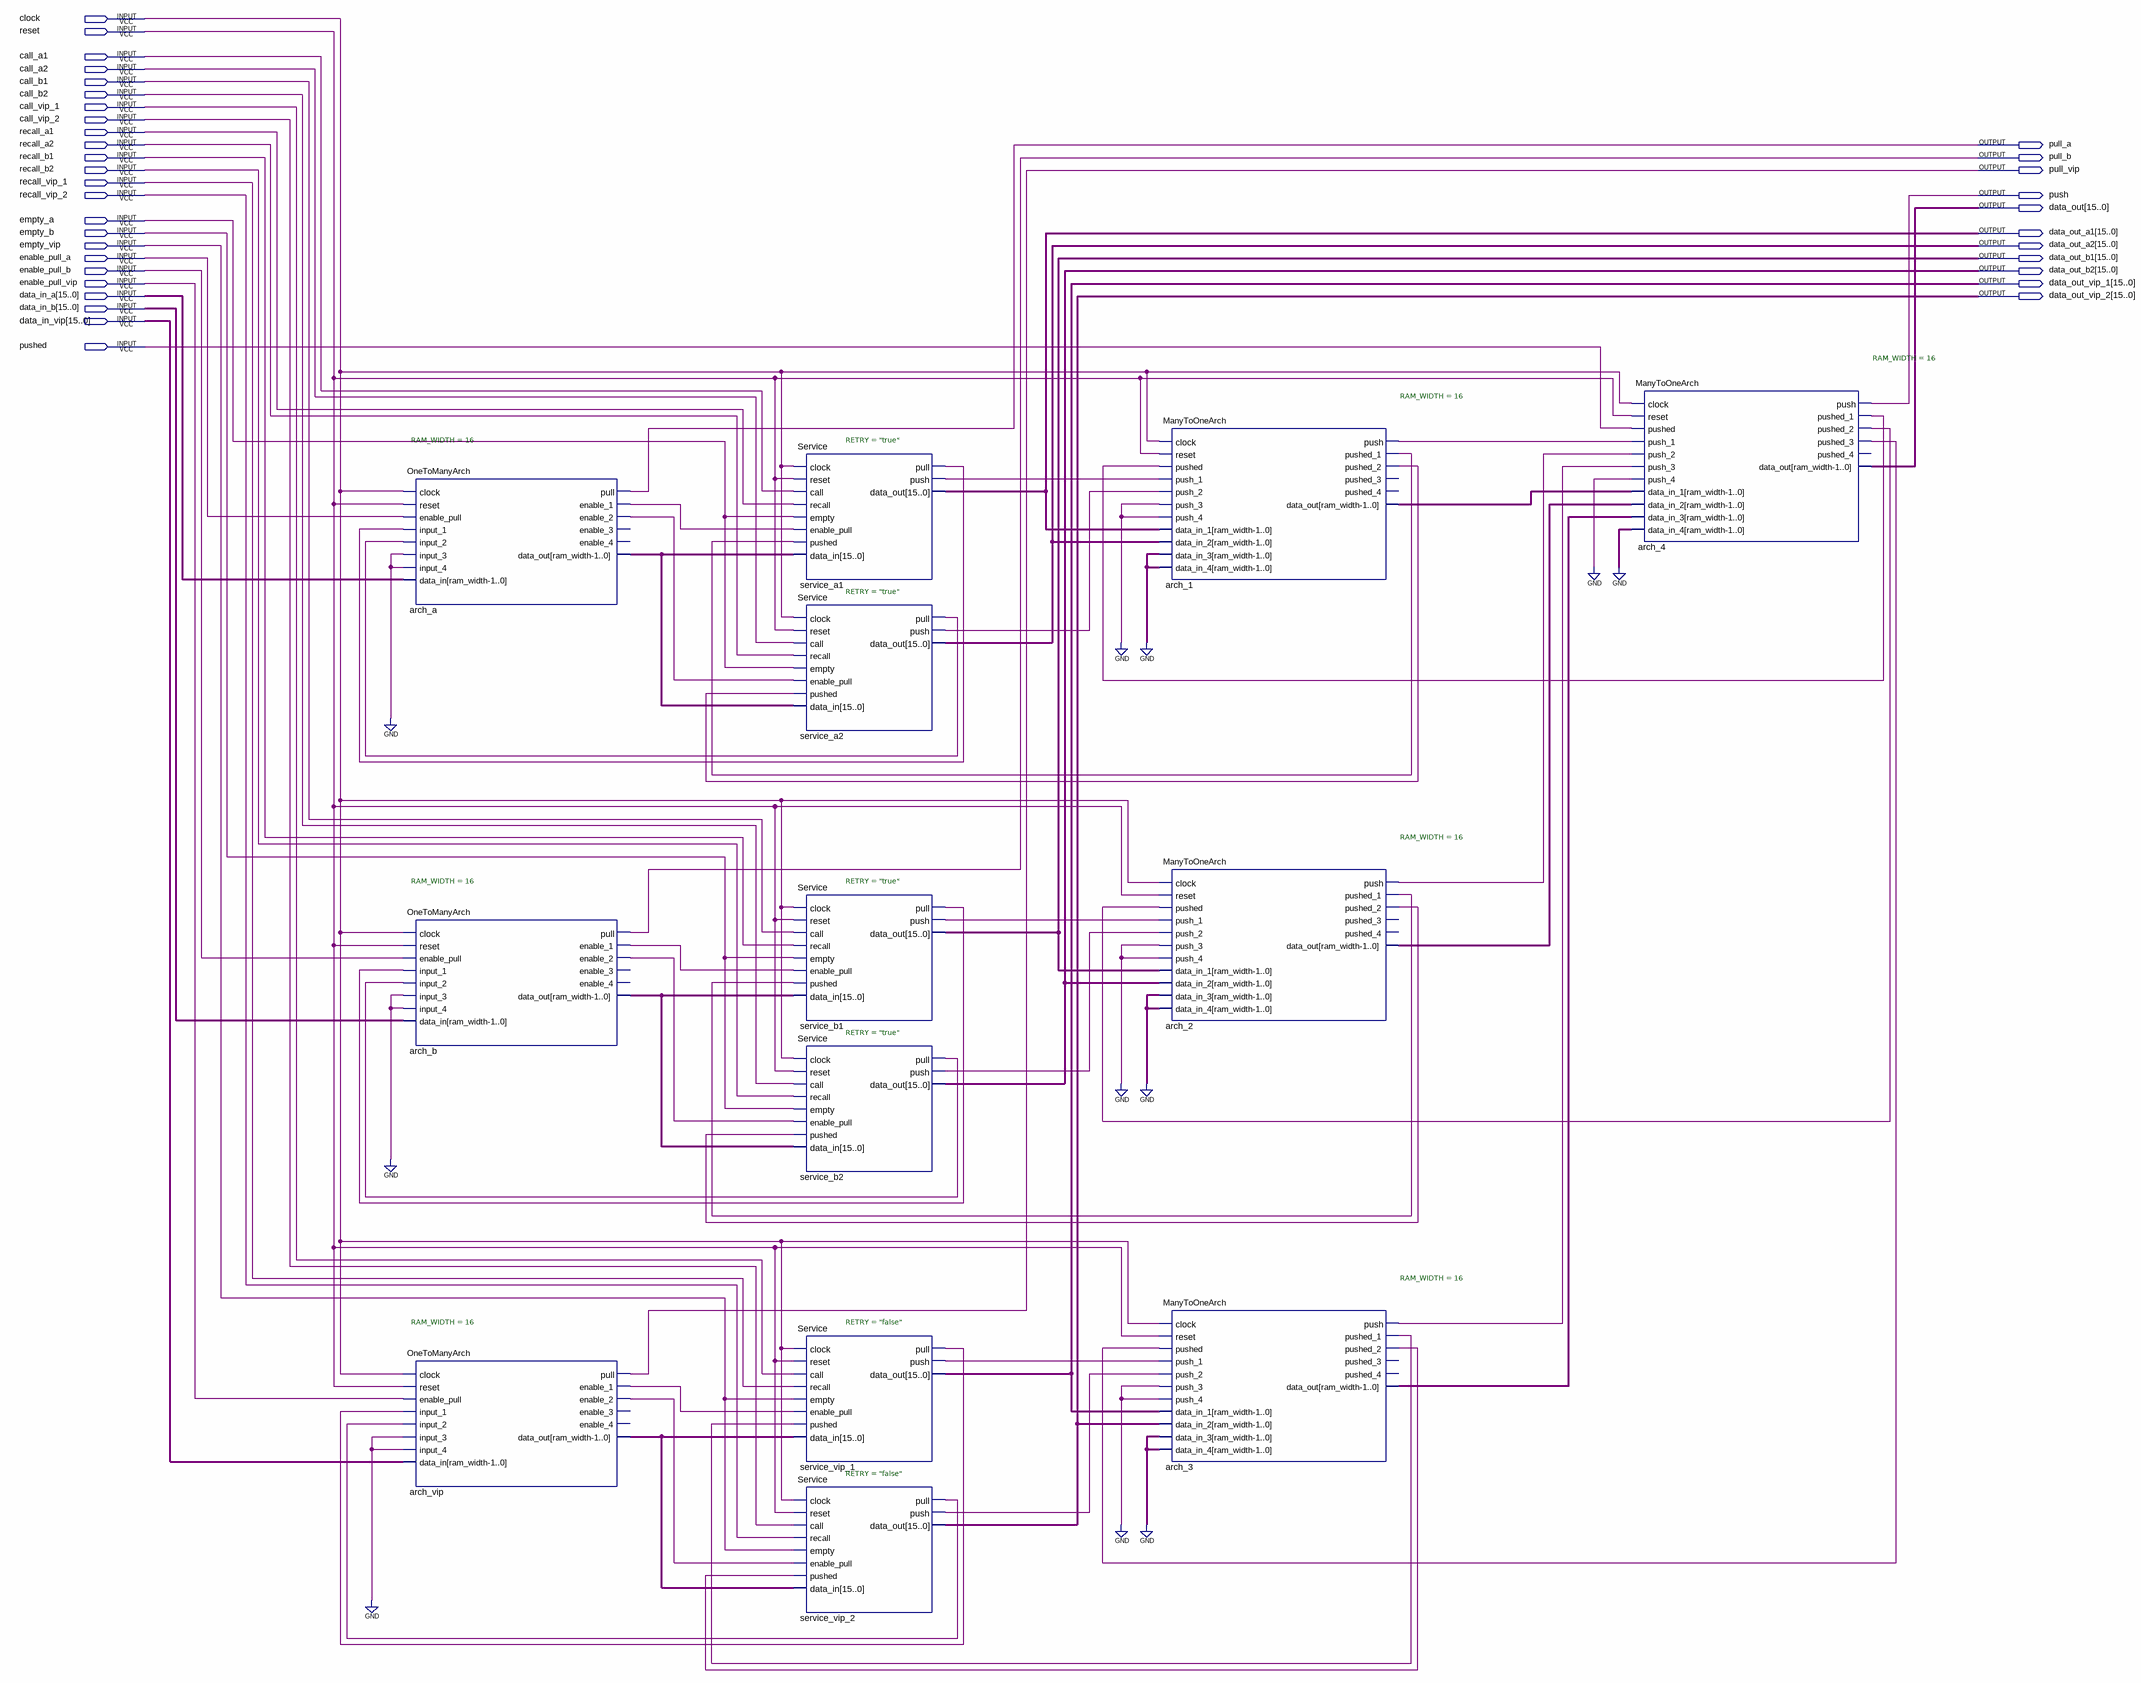
[diagram p0: schematic sheet]
// Quartus schematic TheServices.bdf as structural Verilog: 13 symbols, 35 pins
module TheServices (
  input  clock,
  input  reset,
  input  call_a1,
  input  call_a2,
  input  call_b1,
  input  call_b2,
  input  call_vip_1,
  input  call_vip_2,
  input  recall_a1,
  input  recall_a2,
  input  recall_b1,
  input  recall_b2,
  input  recall_vip_1,
  input  recall_vip_2,
  input  empty_a,
  input  empty_b,
  input  empty_vip,
  input  enable_pull_a,
  input  enable_pull_b,
  input  enable_pull_vip,
  input  [15:0] data_in_a,
  input  [15:0] data_in_b,
  input  [15:0] data_in_vip,
  input  pushed,
  output pull_a,
  output pull_b,
  output pull_vip,
  output push,
  output [15:0] data_out,
  output [15:0] data_out_a1,
  output [15:0] data_out_a2,
  output [15:0] data_out_b1,
  output [15:0] data_out_b2,
  output [15:0] data_out_vip_1,
  output [15:0] data_out_vip_2
);

  wire arch_1_push, arch_1_pushed_1, arch_1_pushed_2, arch_2_push, arch_2_pushed_1, arch_2_pushed_2,
       arch_3_push, arch_3_pushed_1, arch_3_pushed_2, arch_4_pushed_1, arch_4_pushed_2, arch_4_pushed_3,
       arch_a_enable_1, arch_a_enable_2, arch_b_enable_1, arch_b_enable_2, arch_vip_enable_1,
       arch_vip_enable_2, service_a1_pull, service_a1_push, service_a2_pull, service_a2_push,
       service_b1_pull, service_b1_push, service_b2_pull, service_b2_push, service_vip_1_pull,
       service_vip_1_push, service_vip_2_pull, service_vip_2_push;
  wire [15:0] arch_1_data_out, arch_2_data_out, arch_3_data_out, arch_a_data_out, arch_b_data_out,
       arch_vip_data_out;

  OneToManyArch #(.RAM_WIDTH(16)) arch_a (
    .clock(clock), .reset(reset), .enable_pull(enable_pull_a), .input_1(service_a1_pull),
    .input_2(service_a2_pull), .input_3(1'b0), .input_4(1'b0), .data_in(data_in_a), .pull(pull_a),
    .enable_1(arch_a_enable_1), .enable_2(arch_a_enable_2), .data_out(arch_a_data_out));  // open: enable_3, enable_4
  OneToManyArch #(.RAM_WIDTH(16)) arch_b (
    .clock(clock), .reset(reset), .enable_pull(enable_pull_b), .input_1(service_b1_pull),
    .input_2(service_b2_pull), .input_3(1'b0), .input_4(1'b0), .data_in(data_in_b), .pull(pull_b),
    .enable_1(arch_b_enable_1), .enable_2(arch_b_enable_2), .data_out(arch_b_data_out));  // open: enable_3, enable_4
  OneToManyArch #(.RAM_WIDTH(16)) arch_vip (
    .clock(clock), .reset(reset), .enable_pull(enable_pull_vip), .input_1(service_vip_1_pull),
    .input_2(service_vip_2_pull), .input_3(1'b0), .input_4(1'b0), .data_in(data_in_vip), .pull(pull_vip),
    .enable_1(arch_vip_enable_1), .enable_2(arch_vip_enable_2), .data_out(arch_vip_data_out));  // open: enable_3, enable_4
  Service #(.RETRY("true")) service_a1 (
    .clock(clock), .reset(reset), .call(call_a1), .recall(recall_a1), .empty(empty_a),
    .enable_pull(arch_a_enable_1), .pushed(arch_1_pushed_1), .data_in(arch_a_data_out),
    .pull(service_a1_pull), .push(service_a1_push), .data_out(data_out_a1));
  Service #(.RETRY("true")) service_a2 (
    .clock(clock), .reset(reset), .call(call_a2), .recall(recall_a2), .empty(empty_a),
    .enable_pull(arch_a_enable_2), .pushed(arch_1_pushed_2), .data_in(arch_a_data_out),
    .pull(service_a2_pull), .push(service_a2_push), .data_out(data_out_a2));
  Service #(.RETRY("true")) service_b1 (
    .clock(clock), .reset(reset), .call(call_b1), .recall(recall_b1), .empty(empty_b),
    .enable_pull(arch_b_enable_1), .pushed(arch_2_pushed_1), .data_in(arch_b_data_out),
    .pull(service_b1_pull), .push(service_b1_push), .data_out(data_out_b1));
  Service #(.RETRY("true")) service_b2 (
    .clock(clock), .reset(reset), .call(call_b2), .recall(recall_b2), .empty(empty_b),
    .enable_pull(arch_b_enable_2), .pushed(arch_2_pushed_2), .data_in(arch_b_data_out),
    .pull(service_b2_pull), .push(service_b2_push), .data_out(data_out_b2));
  Service #(.RETRY("false")) service_vip_1 (
    .clock(clock), .reset(reset), .call(call_vip_1), .recall(recall_vip_1), .empty(empty_vip),
    .enable_pull(arch_vip_enable_1), .pushed(arch_3_pushed_1), .data_in(arch_vip_data_out),
    .pull(service_vip_1_pull), .push(service_vip_1_push), .data_out(data_out_vip_1));
  Service #(.RETRY("false")) service_vip_2 (
    .clock(clock), .reset(reset), .call(call_vip_2), .recall(recall_vip_2), .empty(empty_vip),
    .enable_pull(arch_vip_enable_2), .pushed(arch_3_pushed_2), .data_in(arch_vip_data_out),
    .pull(service_vip_2_pull), .push(service_vip_2_push), .data_out(data_out_vip_2));
  ManyToOneArch #(.RAM_WIDTH(16)) arch_1 (
    .clock(clock), .reset(reset), .pushed(arch_4_pushed_1), .push_1(service_a1_push),
    .push_2(service_a2_push), .push_3(1'b0), .push_4(1'b0), .data_in_1(data_out_a1), .data_in_2(data_out_a2),
    .data_in_3({16{1'b0}}), .data_in_4({16{1'b0}}), .push(arch_1_push), .pushed_1(arch_1_pushed_1),
    .pushed_2(arch_1_pushed_2), .data_out(arch_1_data_out));  // open: pushed_3, pushed_4
  ManyToOneArch #(.RAM_WIDTH(16)) arch_2 (
    .clock(clock), .reset(reset), .pushed(arch_4_pushed_2), .push_1(service_b1_push),
    .push_2(service_b2_push), .push_3(1'b0), .push_4(1'b0), .data_in_1(data_out_b1), .data_in_2(data_out_b2),
    .data_in_3({16{1'b0}}), .data_in_4({16{1'b0}}), .push(arch_2_push), .pushed_1(arch_2_pushed_1),
    .pushed_2(arch_2_pushed_2), .data_out(arch_2_data_out));  // open: pushed_3, pushed_4
  ManyToOneArch #(.RAM_WIDTH(16)) arch_3 (
    .clock(clock), .reset(reset), .pushed(arch_4_pushed_3), .push_1(service_vip_1_push),
    .push_2(service_vip_2_push), .push_3(1'b0), .push_4(1'b0), .data_in_1(data_out_vip_1),
    .data_in_2(data_out_vip_2), .data_in_3({16{1'b0}}), .data_in_4({16{1'b0}}), .push(arch_3_push),
    .pushed_1(arch_3_pushed_1), .pushed_2(arch_3_pushed_2), .data_out(arch_3_data_out));  // open: pushed_3, pushed_4
  ManyToOneArch #(.RAM_WIDTH(16)) arch_4 (
    .clock(clock), .reset(reset), .pushed(pushed), .push_1(arch_1_push), .push_2(arch_2_push),
    .push_3(arch_3_push), .push_4(1'b0), .data_in_1(arch_1_data_out), .data_in_2(arch_2_data_out),
    .data_in_3(arch_3_data_out), .data_in_4({16{1'b0}}), .push(push), .pushed_1(arch_4_pushed_1),
    .pushed_2(arch_4_pushed_2), .pushed_3(arch_4_pushed_3), .data_out(data_out));  // open: pushed_4
endmodule
